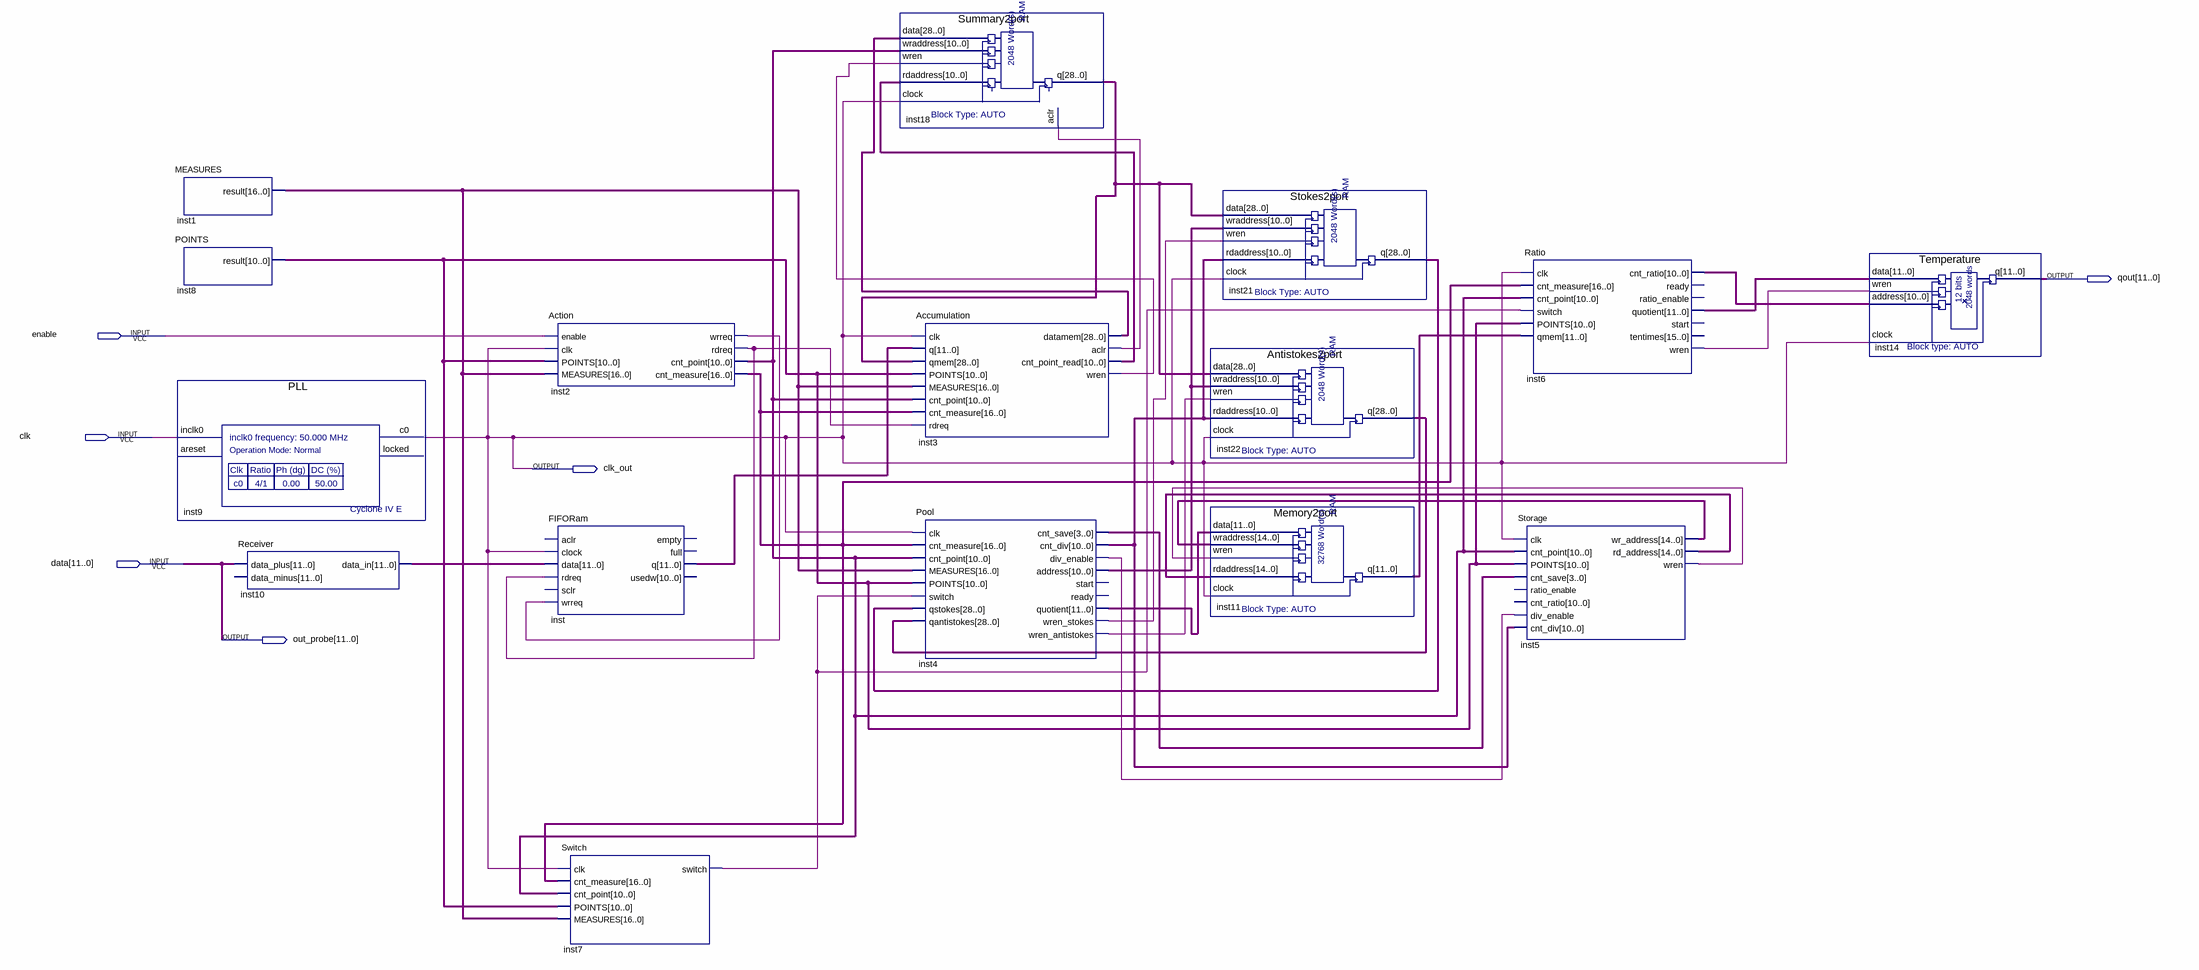
[diagram p0: schematic sheet]
// Quartus schematic Raman.bdf as structural Verilog: 16 symbols, 6 pins
module Raman (
  input  enable,
  input  clk,
  input  [11:0] data,
  output [11:0] qout,
  output clk_out,
  output [11:0] out_probe
);

  wire inst2_rdreq, inst2_wrreq, inst3_aclr, inst3_wren, inst4_div_enable, inst4_wren_antistokes,
       inst4_wren_stokes, inst5_wren, inst6_wren, inst7_switch;
  wire [3:0] inst4_cnt_save;
  wire [10:0] inst2_cnt_point, inst3_cnt_point_read, inst4_address, inst4_cnt_div, inst6_cnt_ratio,
       inst8_result;
  wire [11:0] inst4_quotient, inst6_quotient, inst10_data_in, inst11_q, inst_q;
  wire [14:0] inst5_rd_address, inst5_wr_address;
  wire [16:0] inst1_result, inst2_cnt_measure;
  wire [28:0] inst3_datamem, inst18_q, inst21_q, inst22_q;

  MEASURES inst1 (.result(inst1_result));
  POINTS inst8 (.result(inst8_result));
  PLL inst9 (.inclk0(clk), .c0(clk_out));  // open: areset, locked
  Receiver inst10 (.data_plus(data), .data_in(inst10_data_in));  // open: data_minus
  Action inst2 (
    .enable(enable), .clk(clk_out), .POINTS(inst8_result), .MEASURES(inst1_result), .wrreq(inst2_wrreq),
    .rdreq(inst2_rdreq), .cnt_point(inst2_cnt_point), .cnt_measure(inst2_cnt_measure));
  FIFORam inst (
    .clock(clk_out), .data(inst10_data_in), .rdreq(inst2_rdreq), .wrreq(inst2_wrreq), .q(inst_q));  // open: aclr, sclr, empty, full, usedw
  Switch inst7 (
    .clk(clk_out), .cnt_measure(inst2_cnt_measure), .cnt_point(inst2_cnt_point), .POINTS(inst8_result),
    .MEASURES(inst1_result), .switch(inst7_switch));
  Summary2port inst18 (
    .data(inst3_datamem), .wraddress(inst2_cnt_point), .wren(inst3_wren), .rdaddress(inst3_cnt_point_read),
    .clock(clk_out), .aclr(inst3_aclr), .q(inst18_q));
  Accumulation inst3 (
    .clk(clk_out), .q(inst_q), .qmem(inst18_q), .POINTS(inst8_result), .MEASURES(inst1_result),
    .cnt_point(inst2_cnt_point), .cnt_measure(inst2_cnt_measure), .rdreq(inst2_rdreq),
    .datamem(inst3_datamem), .aclr(inst3_aclr), .cnt_point_read(inst3_cnt_point_read), .wren(inst3_wren));
  Pool inst4 (
    .clk(clk_out), .cnt_measure(inst2_cnt_measure), .cnt_point(inst2_cnt_point), .MEASURES(inst1_result),
    .POINTS(inst8_result), .switch(inst7_switch), .qstokes(inst21_q), .qantistokes(inst22_q),
    .cnt_save(inst4_cnt_save), .cnt_div(inst4_cnt_div), .div_enable(inst4_div_enable),
    .address(inst4_address), .quotient(inst4_quotient), .wren_stokes(inst4_wren_stokes),
    .wren_antistokes(inst4_wren_antistokes));  // open: start, ready
  Stokes2port inst21 (
    .data(inst18_q), .wraddress(inst4_address), .wren(inst4_wren_stokes), .rdaddress(inst4_cnt_div),
    .clock(clk_out), .q(inst21_q));
  Antistokes2port inst22 (
    .data(inst18_q), .wraddress(inst4_address), .wren(inst4_wren_antistokes), .rdaddress(inst4_cnt_div),
    .clock(clk_out), .q(inst22_q));
  Memory2port inst11 (
    .data(inst4_quotient), .wraddress(inst5_wr_address), .wren(inst5_wren), .rdaddress(inst5_rd_address),
    .clock(clk_out), .q(inst11_q));
  Ratio inst6 (
    .clk(clk_out), .cnt_measure(inst2_cnt_measure), .cnt_point(inst2_cnt_point), .switch(inst7_switch),
    .POINTS(inst8_result), .qmem(inst11_q), .cnt_ratio(inst6_cnt_ratio), .quotient(inst6_quotient),
    .wren(inst6_wren));  // open: ready, ratio_enable, start, tentimes
  Storage inst5 (
    .clk(clk_out), .cnt_point(inst2_cnt_point), .POINTS(inst8_result), .cnt_save(inst4_cnt_save),
    .div_enable(inst4_div_enable), .cnt_div(inst4_cnt_div), .wr_address(inst5_wr_address),
    .rd_address(inst5_rd_address), .wren(inst5_wren));  // open: ratio_enable, cnt_ratio
  Temperature inst14 (.data(inst6_quotient), .wren(inst6_wren), .address(inst6_cnt_ratio), .clock(clk_out), .q(qout));

  assign out_probe = data;
endmodule
